# EAGLE schematic GVSwire1 (EAGLE 7.0.0)
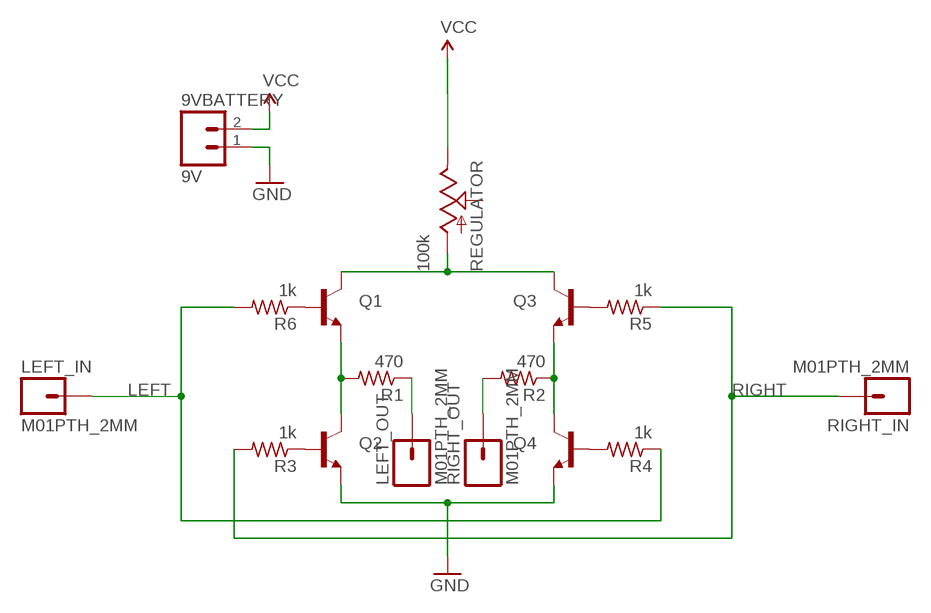
[diagram p0: schematic, sheet 1]

## Parts
9VBATTERY  9V  M02  [1X02_LONGPADS]
LEFT_IN  M01PTH_2MM  [1X01_2MM]
LEFT_OUT  M01PTH_2MM  [1X01_2MM]
Q1  TRANSISTOR_NPNTO92  [TO-92]
Q2  TRANSISTOR_NPNTO92  [TO-92]
Q3  TRANSISTOR_NPNTO92  [TO-92]
Q4  TRANSISTOR_NPNTO92  [TO-92]
R1  470  R-US_FLIPFLOP7  [0805-THM-7]
R2  470  R-US_FLIPFLOP7  [0805-THM-7]
R3  1k  R-US_FLIPFLOP7  [0805-THM-7]
R4  1k  R-US_FLIPFLOP7  [0805-THM-7]
R5  1k  R-US_FLIPFLOP7  [0805-THM-7]
R6  1k  R-US_FLIPFLOP7  [0805-THM-7]
REGULATOR  100k  POT  [ALPS_POT]
RIGHT_IN  M01PTH_2MM  [1X01_2MM]
RIGHT_OUT  M01PTH_2MM  [1X01_2MM]

## Nets
GND: 9VBATTERY.1 Q2.1(E) Q4.1(E)
LEFT: LEFT_IN.1 R4.1 R6.2
N$1: Q2.2(B) R3.1
N$2: Q4.2(B) R4.2
N$3: Q3.2(B) R5.2
N$4: Q1.2(B) R6.1
N$5: Q1.1(E) Q2.3(C) R1.2
N$6: Q3.1(E) Q4.3(C) R2.1
N$7: LEFT_OUT.1 R1.1
N$11: R2.2 RIGHT_OUT.1
POT: Q1.3(C) Q3.3(C) REGULATOR.P$3(A)
RIGHT: R3.2 R5.1 RIGHT_IN.1
VCC: 9VBATTERY.2 REGULATOR.P$1(E)
Unconnected: REGULATOR.P$2(S)

## Library data of the parts
9VBATTERY = SparkFun:M02: Header 2 Standard 2-pin 0.1" header. Use with straight break away headers (SKU : PRT-00116), right angle break away headers (PRT-00553), swiss pins (PRT-00743), machine pins (PRT-00117), and female headers (PRT-00115). Molex polarized connector foot print use with SKU : PRT-08233 with associated crimp pins and housings.
LEFT_IN LEFT_OUT RIGHT_IN RIGHT_OUT = SparkFun:M01: Header 1 Standard 1-pin 0.1" header. Use with straight break away headers (SKU : PRT-00116), right angle break away headers (PRT-00553), swiss pins (PRT-00743), machine pins (PRT-00117), and female headers (PRT-00115).
Q1-Q4 = SparkFun:TRANSISTOR_NPN: Transistor NPN BJT configuration in SOT23 package. MMBT2222 is the common NPN we use. Double check BCE configuration again layout.
R1-R6 = adafruit:R-US_: RESISTOR, American symbol
REGULATOR = SparkFun:POT